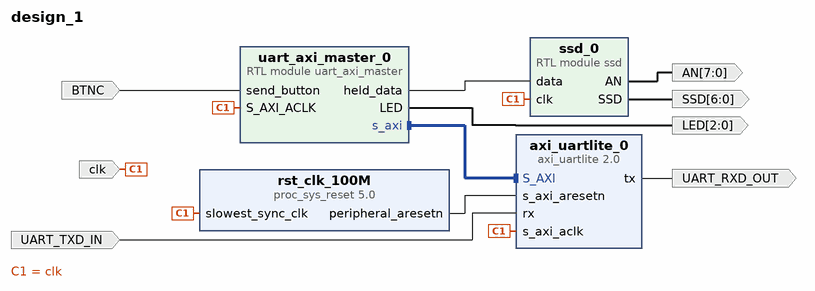
[diagram p0: block diagram of the top level]
# Vivado block design design_1, xc7a100tcsg324-1, Vivado 2020.2
create_bd_design design_1

create_bd_port -dir I -type data UART_TXD_IN
create_bd_port -dir O -type data UART_RXD_OUT
create_bd_port -dir I -type clk clk
set_property -dict {CONFIG.FREQ_HZ 100000000} [get_bd_ports clk]
create_bd_port -dir O -from 6 -to 0 -type data SSD
create_bd_port -dir O -from 7 -to 0 -type data AN
create_bd_port -dir I -type data BTNC
create_bd_port -dir O -from 2 -to 0 -type data LED

create_bd_cell -type ip -vlnv xilinx.com:ip:axi_uartlite:2.0 axi_uartlite_0
set_property -dict [list \
  CONFIG.C_BAUDRATE 57600 \
  CONFIG.C_ODD_PARITY 0 \
  CONFIG.C_USE_PARITY 0 \
  CONFIG.PARITY No_Parity \
] [get_bd_cells axi_uartlite_0]
create_bd_cell -type ip -vlnv xilinx.com:ip:proc_sys_reset:5.0 rst_clk_100M
create_bd_cell -type module -reference ssd ssd_0
create_bd_cell -type module -reference uart_axi_master uart_axi_master_0

# ---- connections ----

connect_bd_intf_net [get_bd_intf_pins uart_axi_master_0/s_axi] [get_bd_intf_pins axi_uartlite_0/S_AXI]
connect_bd_net [get_bd_pins axi_uartlite_0/tx] [get_bd_ports UART_RXD_OUT]
connect_bd_net [get_bd_ports UART_TXD_IN] [get_bd_pins axi_uartlite_0/rx]
connect_bd_net [get_bd_ports clk] \
  [get_bd_pins axi_uartlite_0/s_axi_aclk] [get_bd_pins rst_clk_100M/slowest_sync_clk] [get_bd_pins ssd_0/clk] \
  [get_bd_pins uart_axi_master_0/S_AXI_ACLK]
connect_bd_net [get_bd_pins ssd_0/SSD] [get_bd_ports SSD]
connect_bd_net [get_bd_pins ssd_0/AN] [get_bd_ports AN]
connect_bd_net [get_bd_ports BTNC] [get_bd_pins uart_axi_master_0/send_button]
connect_bd_net [get_bd_pins uart_axi_master_0/held_data] [get_bd_pins ssd_0/data]
connect_bd_net [get_bd_pins uart_axi_master_0/LED] [get_bd_ports LED]
connect_bd_net [get_bd_pins rst_clk_100M/peripheral_aresetn] [get_bd_pins axi_uartlite_0/s_axi_aresetn]

# ---- address map ----
assign_bd_address -offset 0x1000 -range 4K -target_address_space [get_bd_addr_spaces uart_axi_master_0/s_axi] [get_bd_addr_segs axi_uartlite_0/S_AXI/Reg]

validate_bd_design
save_bd_design
